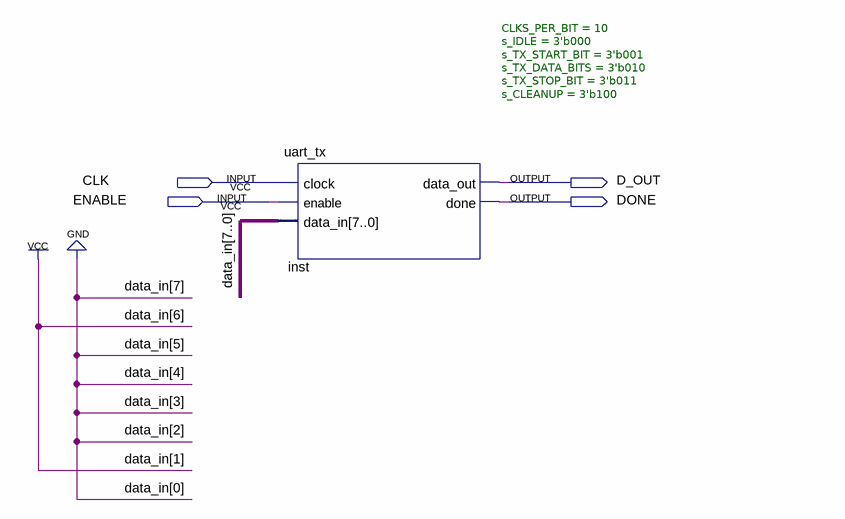
[diagram p0: schematic sheet]
// Quartus schematic TX_Placa.bdf as structural Verilog: 1 symbols, 4 pins
module TX_Placa (
  input  CLK,
  input  ENABLE,
  output D_OUT,
  output DONE
);

  uart_tx #(.CLKS_PER_BIT(10), .s_IDLE(3'b000), .s_TX_START_BIT(3'b001), .s_TX_DATA_BITS(3'b010), .s_TX_STOP_BIT(3'b011), .s_CLEANUP(3'b100)) inst (
    .clock(CLK), .enable(ENABLE), .data_in(8'b01000010), .data_out(D_OUT), .done(DONE));
endmodule
